# Altium project LED.PrjPcb
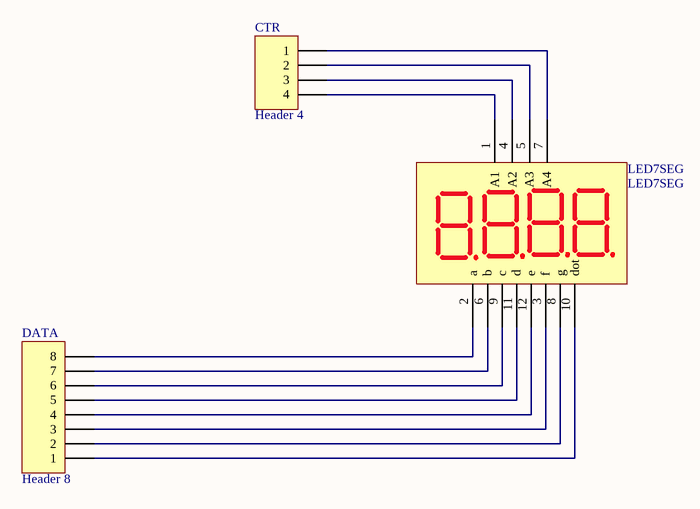
[diagram p0: LED.SchDoc]
1 sheet, 3 parts. Net scope: global (net labels, ports and power ports of the same name join across sheets).
Board file: LED.PcbDoc

## Sheet LED.SchDoc
size A

### Parts
CTR  Header 4  [CAP 4]
DATA  Header 8  [Cap_8]
LED7SEG  LED7SEG  [LED7SEGMENT_4]

### Nets
NetCTR_1: CTR.1 LED7SEG.7(A4)
NetCTR_2: CTR.2 LED7SEG.5(A3)
NetCTR_3: CTR.3 LED7SEG.4(A2)
NetCTR_4: CTR.4 LED7SEG.1(A1)
NetDATA_1: DATA.1 LED7SEG.10(dot)
NetDATA_2: DATA.2 LED7SEG.8(g)
NetDATA_3: DATA.3 LED7SEG.3(f)
NetDATA_4: DATA.4 LED7SEG.12(e)
NetDATA_5: DATA.5 LED7SEG.11(d)
NetDATA_6: DATA.6 LED7SEG.9(c)
NetDATA_7: DATA.7 LED7SEG.6(b)
NetDATA_8: DATA.8 LED7SEG.2(a)

### Library data of the parts
CTR = Header 4: Header, 4-Pin; LatestRevisionDate: 17-Jul-2002; LatestRevisionNote: Re-released for DXP Platform.; Publisher: Altium Limited
DATA = Header 8: Header, 8-Pin; LatestRevisionDate: 17-Jul-2002; LatestRevisionNote: Re-released for DXP Platform.; Publisher: Altium Limited